# EAGLE design core (EAGLE 6.6.0)

## Sheet 1 of 2
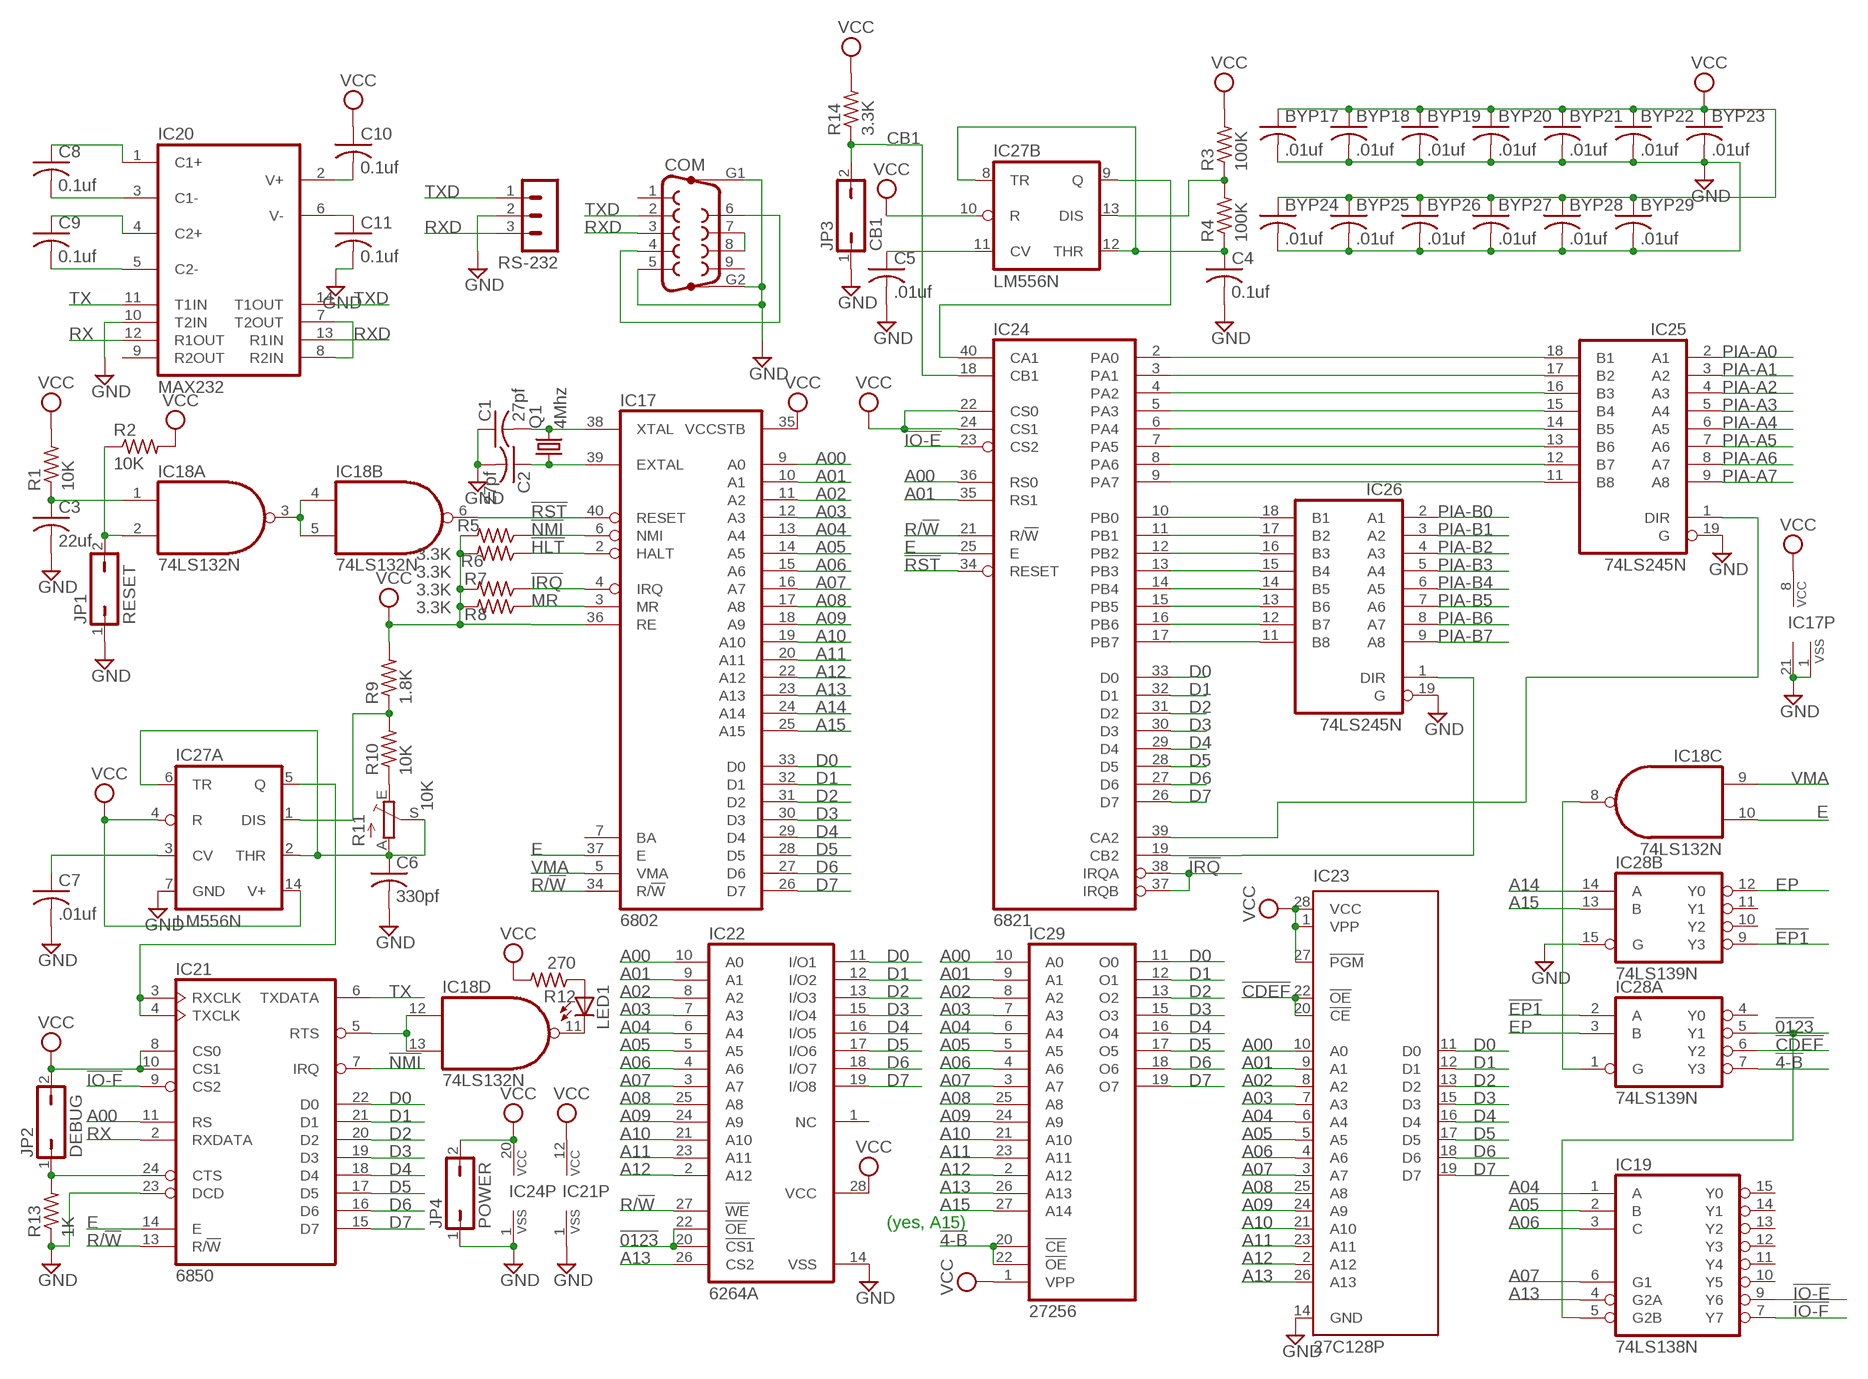
[diagram p0: schematic, sheet 1]

### Parts
BYP17  .01uf  C-US050-025X075  [C050-025X075]
BYP18  .01uf  C-US050-025X075  [C050-025X075]
BYP19  .01uf  C-US050-025X075  [C050-025X075]
BYP20  .01uf  C-US050-025X075  [C050-025X075]
BYP21  .01uf  C-US050-025X075  [C050-025X075]
BYP22  .01uf  C-US050-025X075  [C050-025X075]
BYP23  .01uf  C-US050-025X075  [C050-025X075]
BYP24  .01uf  C-US050-025X075  [C050-025X075]
BYP25  .01uf  C-US050-025X075  [C050-025X075]
BYP26  .01uf  C-US050-025X075  [C050-025X075]
BYP27  .01uf  C-US050-025X075  [C050-025X075]
BYP28  .01uf  C-US050-025X075  [C050-025X075]
BYP29  .01uf  C-US050-025X075  [C050-025X075]
C1  27pf  C-US050-025X075  [C050-025X075]
C2  27pf  C-US050-025X075  [C050-025X075]
C3  22uf  C-US102-043X133  [C102-043X133]
C4  0.1uf  C-US050-025X075  [C050-025X075]
C5  .01uf  C-US050-025X075  [C050-025X075]
C6  330pf  C-US050-025X075  [C050-025X075]
C7  .01uf  C-US050-025X075  [C050-025X075]
C8  0.1uf  C-US050-025X075  [C050-025X075]
C9  0.1uf  C-US050-025X075  [C050-025X075]
C10  0.1uf  C-US050-025X075  [C050-025X075]
C11  0.1uf  C-US050-025X075  [C050-025X075]
COM  F09HP  [F09HP]
IC17  6802  [DIL40]
IC18  74LS132N  74LS00N  [DIL14]
IC19  74LS138N  [DIL16]
IC20  MAX232  [DIL16]
IC21  6850  [DIL24]
IC22  6264A  [DIL28-6]
IC23  27C128P  [DIL28-6]
IC24  6821  [DIL40]
IC25  74LS245N  [DIL20]
IC26  74LS245N  [DIL20]
IC27  LM556N  [DIL14]
IC28  74LS139N  [DIL16]
IC29  27256  [DIL28]
JP1  RESET  JP1Q  [JP1]
JP2  DEBUG  JP1Q  [JP1]
JP3  CB1  JP1Q  [JP1]
JP4  POWER  JP1Q  [JP1]
LED1  LED3MM  [LED3MM]
Q1  4Mhz  CRYSTALHC18U-V  [HC18U-V]
R1  10K  R-US_0207/7  [0207/7]
R2  10K  R-US_0207/7  [0207/7]
R3  100K  R-US_0207/7  [0207/7]
R4  100K  R-US_0207/7  [0207/7]
R5  3.3K  R-US_0207/7  [0207/7]
R6  3.3K  R-US_0207/7  [0207/7]
R7  3.3K  R-US_0207/7  [0207/7]
R8  3.3K  R-US_0207/7  [0207/7]
R9  1.8K  R-US_0207/7  [0207/7]
R10  10K  R-US_0207/7  [0207/7]
R11  10K  TRIM_EU-B90P  [SP19L]
R12  270  R-US_0207/7  [0207/7]
R13  1K  R-US_0207/7  [0207/7]
R14  3.3K  R-US_0207/7  [0207/7]
RS-232  MA03-1  [MA03-1]

### Nets
!4-B: IC28.7(A:Y3) IC29.20(!CE) IC29.22(!OE)
!0123: IC19.5(G2B) IC22.20(!CS1) IC22.22(!OE) IC28.5(A:Y1)
!CDEF: IC23.20(!CE) IC23.22(!OE) IC28.6(A:Y2)
!EP1: IC28.2(A:A) IC28.9(B:Y3)
!HLT: IC17.2(HALT) R5.1
!IO-E: IC19.9(Y6) IC24.23(CS2)
!IO-F: IC19.7(Y7) IC21.9(CS2)
!IRQ: IC17.4(IRQ) IC24.37(IRQB) IC24.38(IRQA) R7.1
!NMI: IC17.6(NMI) IC21.7(IRQ) R6.1
!RST: IC17.40(RESET) IC18.6(B:O) IC24.34(RESET)
A00: IC17.9(A0) IC21.11(RS) IC22.10(A0) IC23.10(A0) IC24.36(RS0) IC29.10(A0)
A01: IC17.10(A1) IC22.9(A1) IC23.9(A1) IC24.35(RS1) IC29.9(A1)
A02: IC17.11(A2) IC22.8(A2) IC23.8(A2) IC29.8(A2)
A03: IC17.12(A3) IC22.7(A3) IC23.7(A3) IC29.7(A3)
A04: IC17.13(A4) IC19.1(A) IC22.6(A4) IC23.6(A4) IC29.6(A4)
A05: IC17.14(A5) IC19.2(B) IC22.5(A5) IC23.5(A5) IC29.5(A5)
A06: IC17.15(A6) IC19.3(C) IC22.4(A6) IC23.4(A6) IC29.4(A6)
A07: IC17.16(A7) IC19.6(G1) IC22.3(A7) IC23.3(A7) IC29.3(A7)
A08: IC17.17(A8) IC22.25(A8) IC23.25(A8) IC29.25(A8)
A09: IC17.18(A9) IC22.24(A9) IC23.24(A9) IC29.24(A9)
A10: IC17.19(A10) IC22.21(A10) IC23.21(A10) IC29.21(A10)
A11: IC17.20(A11) IC22.23(A11) IC23.23(A11) IC29.23(A11)
A12: IC17.22(A12) IC22.2(A12) IC23.2(A12) IC29.2(A12)
A13: IC17.23(A13) IC19.4(G2A) IC22.26(CS2) IC23.26(A13) IC29.26(A13)
A14: IC17.24(A14) IC28.14(B:A)
A15: IC17.25(A15) IC28.13(B:B) IC29.27(A14)
CB1: IC24.18(CB1) JP3.2 R14.1
D0: IC17.33(D0) IC21.22(D0) IC22.11(I/O1) IC23.11(D0) IC24.33(D0) IC29.11(O0)
D1: IC17.32(D1) IC21.21(D1) IC22.12(I/O2) IC23.12(D1) IC24.32(D1) IC29.12(O1)
D2: IC17.31(D2) IC21.20(D2) IC22.13(I/O3) IC23.13(D2) IC24.31(D2) IC29.13(O2)
D3: IC17.30(D3) IC21.19(D3) IC22.15(I/O4) IC23.15(D3) IC24.30(D3) IC29.15(O3)
D4: IC17.29(D4) IC21.18(D4) IC22.16(I/O5) IC23.16(D4) IC24.29(D4) IC29.16(O4)
D5: IC17.28(D5) IC21.17(D5) IC22.17(I/O6) IC23.17(D5) IC24.28(D5) IC29.17(O5)
D6: IC17.27(D6) IC21.16(D6) IC22.18(I/O7) IC23.18(D6) IC24.27(D6) IC29.18(O6)
D7: IC17.26(D7) IC21.15(D7) IC22.19(I/O8) IC23.19(D7) IC24.26(D7) IC29.19(O7)
E: IC17.37(E) IC18.10(C:I1) IC21.14(E) IC24.25(E)
EP: IC28.3(A:B) IC28.12(B:Y0)
GND [Power]: BYP17.2 BYP18.2 BYP19.2 BYP20.2 BYP21.2 BYP22.2 BYP23.2 BYP24.2 BYP25.2 BYP26.2 BYP27.2 BYP28.2 BYP29.2 C1.1 C2.2 C3.2 C4.2 C5.2 C6.2 C7.2 C11.2 COM.5 COM.G1 COM.G2 IC17.1(VSS) IC17.21(VSS) IC20.10(T2IN) IC21.1(VSS) IC21.23(DCD) IC22.14(VSS) IC23.14(GND) IC24.1(VSS) IC25.19(G) IC26.19(G) IC27.7(A:GND) IC28.15(B:G) JP1.1 JP3.1 JP4.1 R13.1 RS-232.2 ; also sheet 2
MR: IC17.3(MR) R8.1
N$1: COM.4 COM.6
N$3: C2.1 IC17.39(EXTAL) Q1.1
N$4: C1.2 IC17.38(XTAL) Q1.2
N$5: IC24.2(PA0) IC25.18(B1)
N$6: IC18.3(A:O) IC18.4(B:I0) IC18.5(B:I1)
N$21: C3.1 IC18.1(A:I0) R1.1
N$22: IC18.2(A:I1) JP1.2 R2.1
N$23: IC21.3(RXCLK) IC21.4(TXCLK) IC27.5(A:Q)
N$24: IC24.10(PB0) IC26.18(B1)
N$25: IC24.11(PB1) IC26.17(B2)
N$27: C6.1 IC27.2(A:THR) IC27.6(A:TR) R11.A R11.S
N$28: IC27.1(A:DIS) R9.1 R10.2
N$94: IC24.12(PB2) IC26.16(B3)
N$124: IC24.13(PB3) IC26.15(B4)
N$125: IC24.14(PB4) IC26.14(B5)
N$126: IC24.15(PB5) IC26.13(B6)
N$127: IC24.16(PB6) IC26.12(B7)
N$128: IC24.17(PB7) IC26.11(B8)
N$129: IC24.3(PA1) IC25.17(B2)
N$130: IC24.4(PA2) IC25.16(B3)
N$131: IC24.5(PA3) IC25.15(B4)
N$132: IC24.6(PA4) IC25.14(B5)
N$133: IC24.7(PA5) IC25.13(B6)
N$134: IC24.8(PA6) IC25.12(B7)
N$135: IC24.9(PA7) IC25.11(B8)
N$136: IC24.19(CB2) IC26.1(DIR)
N$137: IC24.39(CA2) IC25.1(DIR)
N$138: IC24.40(CA1) IC27.9(B:Q)
N$140: C4.1 IC27.8(B:TR) IC27.12(B:THR) R4.1
N$141: IC27.13(B:DIS) R3.1 R4.2
N$142: C5.1 IC27.11(B:CV)
N$143: R10.1 R11.E
N$145: COM.7 COM.8
N$147: IC18.12(D:I0) IC18.13(D:I1) IC21.5(RTS)
N$148: IC18.11(D:O) LED1.K(C)
N$149: LED1.A R12.1
N$150: IC21.24(CTS) JP2.1 R13.2
N$151: IC18.8(C:O) IC28.1(A:G)
N$153: IC20.7(T2OUT) IC20.8(R2IN)
N$154: C7.1 IC27.3(A:CV)
N$155: C9.2 IC20.5(C2-)
N$156: C9.1 IC20.4(C2+)
N$157: C8.2 IC20.3(C1-)
N$158: C8.1 IC20.1(C1+)
N$159: C11.1 IC20.6(V-)
N$160: C10.2 IC20.2(V+)
PIA-A0: IC25.2(A1) ; also sheet 2
PIA-A1: IC25.3(A2) ; also sheet 2
PIA-A2: IC25.4(A3) ; also sheet 2
PIA-A3: IC25.5(A4) ; also sheet 2
PIA-A4: IC25.6(A5) ; also sheet 2
PIA-A5: IC25.7(A6) ; also sheet 2
PIA-A6: IC25.8(A7) ; also sheet 2
PIA-A7: IC25.9(A8) ; also sheet 2
PIA-B0: IC26.2(A1) ; also sheet 2
PIA-B1: IC26.3(A2) ; also sheet 2
PIA-B2: IC26.4(A3) ; also sheet 2
PIA-B3: IC26.5(A4) ; also sheet 2
PIA-B4: IC26.6(A5) ; also sheet 2
PIA-B5: IC26.7(A6) ; also sheet 2
PIA-B6: IC26.8(A7) ; also sheet 2
PIA-B7: IC26.9(A8) ; also sheet 2
R/!W: IC17.34(R/!W) IC21.13(R/!W) IC22.27(!WE) IC24.21(R/!W)
RX: IC20.12(R1OUT) IC21.2(RXDATA)
RXD: COM.3 IC20.13(R1IN) RS-232.3
TX: IC20.11(T1IN) IC21.6(TXDATA)
TXD: COM.2 IC20.14(T1OUT) RS-232.1
VCC [Power]: BYP17.1 BYP18.1 BYP19.1 BYP20.1 BYP21.1 BYP22.1 BYP23.1 BYP24.1 BYP25.1 BYP26.1 BYP27.1 BYP28.1 BYP29.1 C10.1 IC17.8(VCC) IC17.35(VCCSTB) IC17.36(RE) IC21.8(CS0) IC21.10(CS1) IC21.12(VCC) IC22.28(VCC) IC23.1(VPP) IC23.27(!PGM) IC23.28(VCC) IC24.20(VCC) IC24.22(CS0) IC24.24(CS1) IC27.4(A:R) IC27.10(B:R) IC27.14(A:V+) IC29.1(VPP) JP2.2 JP4.2 R1.2 R2.2 R3.2 R5.2 R6.2 R7.2 R8.2 R9.2 R12.2 R14.2 ; also sheet 2
VMA: IC17.5(VMA) IC18.9(C:I0)
Unconnected: COM.1 COM.9 IC17.7(BA) IC19.10(Y5) IC19.11(Y4) IC19.12(Y3) IC19.13(Y2) IC19.14(Y1) IC19.15(Y0) IC20.9(R2OUT) IC22.1(NC) IC28.4(A:Y0) IC28.10(B:Y2) IC28.11(B:Y1)

### Notes on the sheet
- (yes, A15)

## Sheet 2 of 2
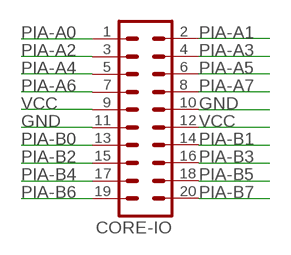
[diagram p1: schematic, sheet 2]

### Parts
CORE-IO  MA10-2  [MA10-2]

### Nets
GND [Power]: CORE-IO.10 CORE-IO.11 ; also sheet 1
PIA-A0: CORE-IO.1 ; also sheet 1
PIA-A1: CORE-IO.2 ; also sheet 1
PIA-A2: CORE-IO.3 ; also sheet 1
PIA-A3: CORE-IO.4 ; also sheet 1
PIA-A4: CORE-IO.5 ; also sheet 1
PIA-A5: CORE-IO.6 ; also sheet 1
PIA-A6: CORE-IO.7 ; also sheet 1
PIA-A7: CORE-IO.8 ; also sheet 1
PIA-B0: CORE-IO.13 ; also sheet 1
PIA-B1: CORE-IO.14 ; also sheet 1
PIA-B2: CORE-IO.15 ; also sheet 1
PIA-B3: CORE-IO.16 ; also sheet 1
PIA-B4: CORE-IO.17 ; also sheet 1
PIA-B5: CORE-IO.18 ; also sheet 1
PIA-B6: CORE-IO.19 ; also sheet 1
PIA-B7: CORE-IO.20 ; also sheet 1
VCC [Power]: CORE-IO.9 CORE-IO.12 ; also sheet 1

## Power pins joined to a net without a drawn wire
GND: IC18.7(P:GND) IC19.8(GND) IC20.15(GND) IC25.10(GND) IC26.10(GND) IC28.8(P:GND) IC29.14(GND)
VCC: IC18.14(P:VCC) IC19.16(VCC) IC20.16(VCC) IC25.20(VCC) IC26.20(VCC) IC28.16(P:VCC) IC29.28(VCC)

## Library data of the parts
BYP17-BYP29 C1-C11 = rcl:C-US: CAPACITOR, American symbol
COM = con-subd:F09HP: SUB-D; OC_FARNELL: unknown; OC_NEWARK: unknown
CORE-IO = con-lstb:MA10-2: PIN HEADER; OC_FARNELL: unknown; OC_NEWARK: unknown
IC17 = micro-motorola:6802: MICROCONTROLLER/MEMORY DEVICE; OC_FARNELL: unknown; OC_NEWARK: unknown
IC18 = 74xx-us:74*00: Quad 2-input NAND gate
IC19 = 74xx-us:74*138: 3-line to 8-line DECODER/DEMULTIPLEXER
IC20 = maxim:MAX232: RS232 TRANSCEIVER; MF: MAXIM; MPN: MAX232ACPE+; OC_FARNELL: 9723773; OC_NEWARK: 68K4544
IC21 = micro-motorola:6850: MICROCONTROLLER/MEMORY DEVICE; MF: NTE ELECTRONICS; MPN: NTE6850; OC_FARNELL: 4899775; OC_NEWARK: 31C2457
IC22 = memory-hitachi:6264A: MEMORY; OC_FARNELL: 283605; OC_NEWARK: unknown
IC23 = microchip:27*128: CMOS EPROM 128 K (16 K x 8); OC_FARNELL: unknown; OC_NEWARK: unknown
IC24 = micro-motorola:6821: MICROCONTROLLER/MEMORY DEVICE; MF: NTE ELECTRONICS; MPN: NTE6821; OC_FARNELL: 1652403; OC_NEWARK: 29C4772
IC25 IC26 = 74xx-us:74*245: Octal BUS TRANSCEIVER, 3-state
IC27 = linear:*556: Dual TIMER
IC28 = 74xx-us:74*139: Dual 2-line to 4-line DECODER/DEMULTIPLEXER
IC29 = memory:27256: MEMORY
JP1-JP4 = jumper:JP1Q: JUMPER
LED1 = led:LED: LED OSRAM: - CHIPLED LG R971, LG N971, LY N971, LG Q971, LY Q971, LO R971, LY R971 LH N974, LH R974 LS Q976, LO Q976, LY Q976 LO Q996 - Hyper CHIPLED LW Q18S LB Q993, LB Q99A, LB R99A - SideLED LS A670, LO A670, LY A670, LG A670, LP A670 LB A673, LV A673, LT A673, LW A673 LH A674 LY A675 LS A676, LA A676, LO A676, LY A676, LW A676 LS A679, LY A679, LG A679 - Hyper Micro SIDELED® LS Y876, LA Y876, LO Y876, LY Y876 LT Y87S - SmartLED LW L88C, LW L88S LB L89C, LB L89S, LG L890 LS L89K, LO L89K, LY L89K LS L896, LA L896, LO L896, LY L896 - TOPLED LS T670, LO T670, LY T670, LG T670, LP T670 LSG T670, LSP T670, LSY T670, LOP T670, LYG T670 LG T671, LOG T671, LSG T671 LB T673, LV T673, LT T673, LW T673 LH T674 LS T676, LA T676, LO T676, LY T676, LB T676, LH T676, LSB T676, LW T676 LB T67C, LV T67C, LT T67C, LS T67K, LO T67K, LY T67K, LW E67C LS E67B, LA E67B, LO E67B, LY E67B, LB E67C, LV E67C, LT E67C LW T67C LS T679, LY T679, LG T679 LS T770, LO T770, LY T770, LG T770, LP T770 LB T773, LV T773, LT T773, LW T773 LH T774 LS E675, LA E675, LY E675, LS T675 LS T776, LA T776, LO T776, LY T776, LB T776 LHGB T686 LT T68C, LB T68C - Hyper Mini TOPLED® LB M676 - Mini TOPLED Santana® LG M470 LS M47K, LO M47K, LY M47K Source: http://www.osram.convergy.de LUXEON: - LUMILED® LXK2-PW12-R00, LXK2-PW12-S00, LXK2-PW14-U00, LXK2-PW14-V00 LXK2-PM12-R00, LXK2-PM12-S00, LXK2-PM14-U00 LXK2-PE12-Q00, LXK2-PE12-R00, LXK2-PE12-S00, LXK2-PE14-T00, LXK2-PE14-U00 LXK2-PB12-K00, LXK2-PB12-L00, LXK2-PB12-M00, LXK2-PB14-N00, LXK2-PB14-P00, LXK2-PB14-Q00 LXK2-PR12-L00, LXK2-PR12-M00, LXK2-PR14-Q00, LXK2-PR14-R00 LXK2-PD12-Q00, LXK2-PD12-R00, LXK2-PD12-S00 LXK2-PH12-R00, LXK2-PH12-S00 LXK2-PL12-P00, LXK2-PL12-Q00, LXK2-PL12-R00 Source: www.luxeon.com KINGBRIGHT: KA-3528ASYC Source: www.kingbright.com
Q1 = crystal:CRYSTAL: CRYSTAL; OC_FARNELL: unknown; OC_NEWARK: unknown
R1-R10 R12-R14 = rcl:R-US_: RESISTOR, American symbol
R11 = pot:TRIM_EU-: POTENTIOMETER
RS-232 = con-lstb:MA03-1: PIN HEADER; OC_FARNELL: unknown; OC_NEWARK: unknown

## Net classes
1 Power: width 0.508 mm, drill 0.254 mm, clearance 0.254 mm

## Board
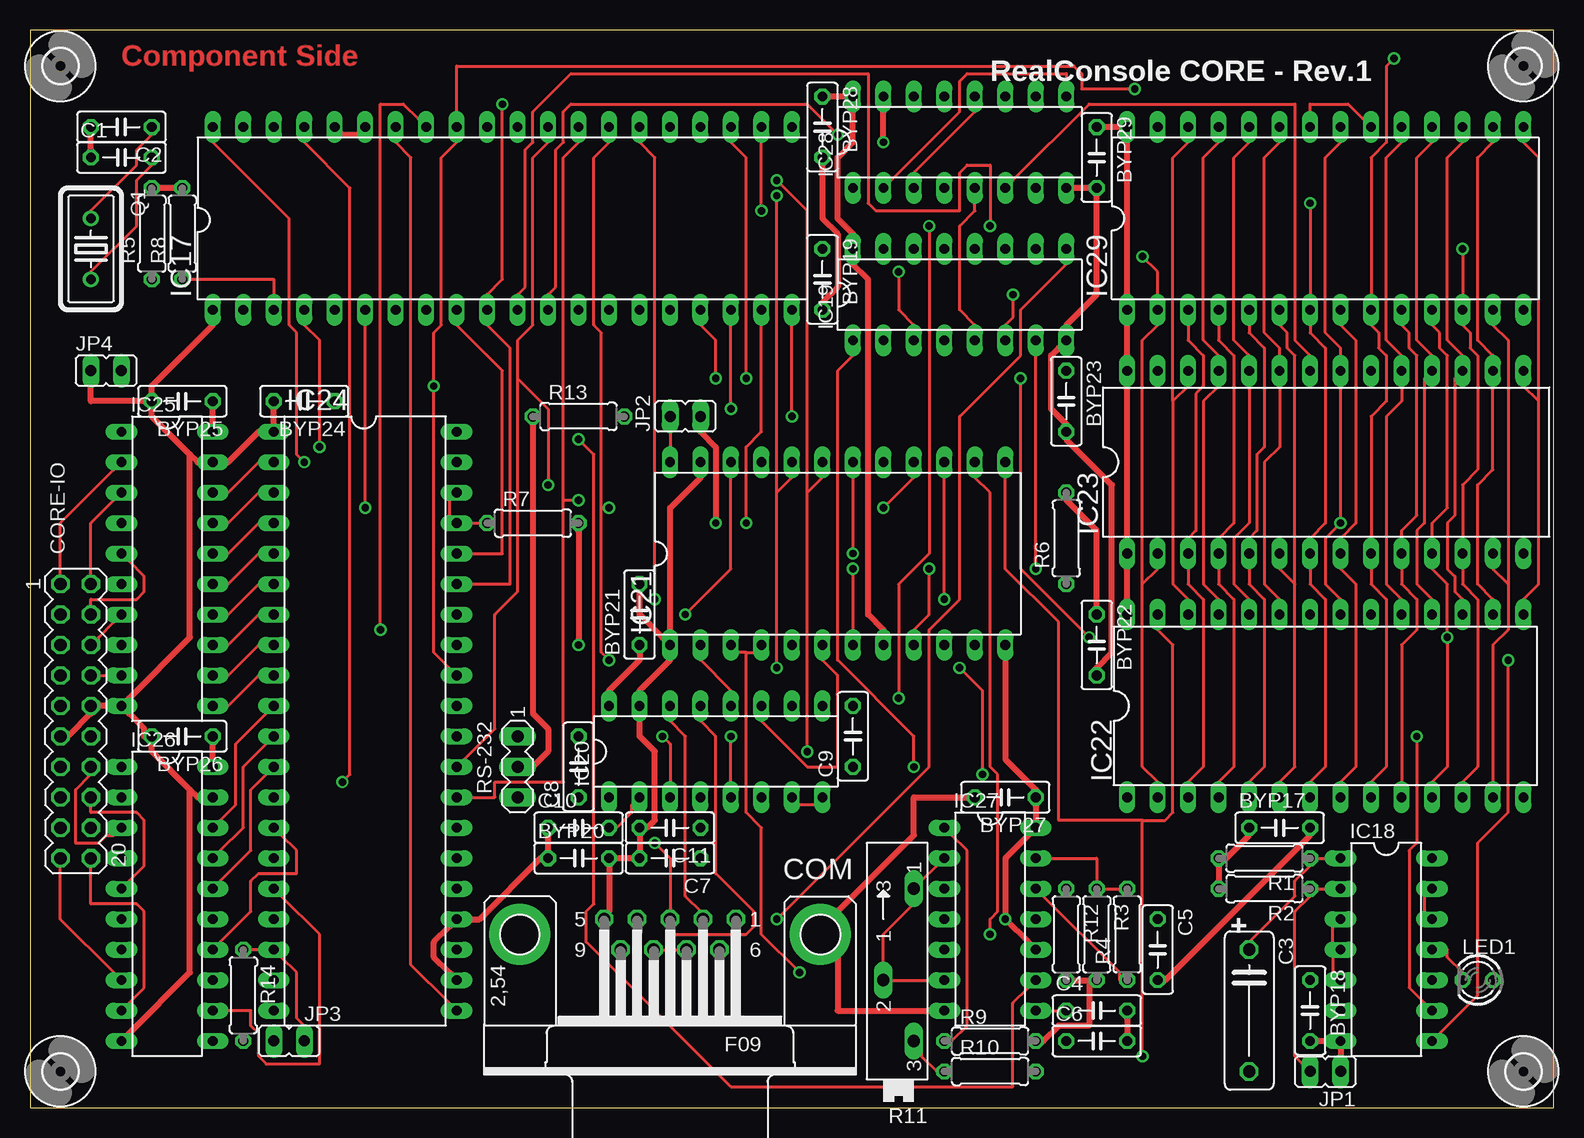
[diagram p2: board, top side]
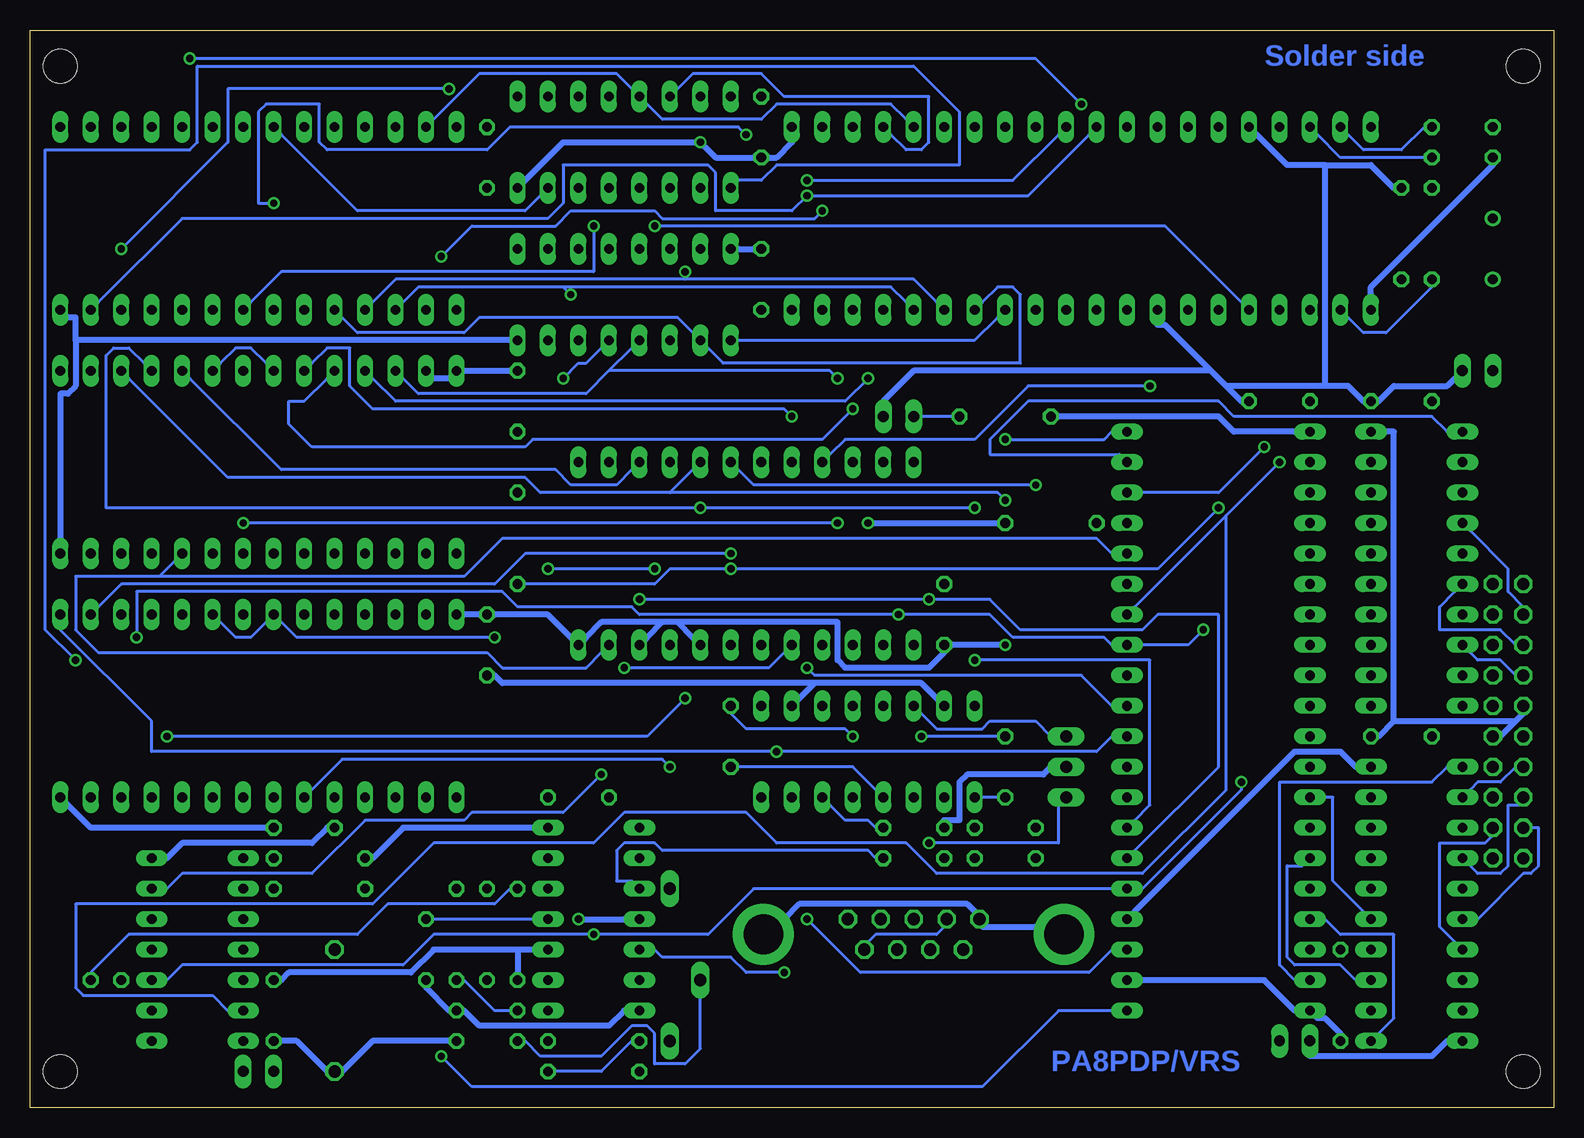
[diagram p3: board, bottom side, seen from below]

Size 126.98 x 89.84 mm. Coordinates in mm from the lower left corner, seen from the top.
Outline: 0,0 126.98,0 126.98,89.84 0,89.84 0,0
Copper layers (1*16): Top 0.035mm / dielectric 1.5mm / Bottom 0.035mm
Design rules "olimex10mil": minimum track width 10mil, minimum drill 24mil, track to track 10mil, track to pad 10mil, pad to pad 10mil, via to via 10mil, smd to smd 10mil, copper to edge 40mil, drill to drill 10mil, minimum pad ring 10mil, minimum via ring 8mil, stop-mask expansion 0mil, vias tented up to drill 0mil, thermal gap 10mil

### Footprints (pad centres in the part's own frame; a part is rotated, then mirrored left to right if it is on the bottom)
C050-025X075 = drill 0.813 octagon: 1 -2.54,0; 2 2.54,0
C102-043X133 = drill 1.016 octagon: 1 -5.08,0; 2 5.08,0
F09HP = drill 1.016 octagon: 1 -5.486,-1.27; 2 -2.743,-1.27; 3 0,-1.27; 4 2.743,-1.27; 5 5.486,-1.27; 6 -4.115,1.27; 7 -1.372,1.27; 8 1.372,1.27; 9 4.115,1.27 | drill 3.302 pad 5.08: G1 -12.522,0; G2 12.522,0
MA10-2 = drill 1.016 octagon: 1 -11.43,-1.27; 2 -11.43,1.27; 3 -8.89,-1.27; 4 -8.89,1.27; 5 -6.35,-1.27; 6 -6.35,1.27; 7 -3.81,-1.27; 8 -3.81,1.27; 9 -1.27,-1.27; 10 -1.27,1.27; 11 1.27,-1.27; 12 1.27,1.27; 13 3.81,-1.27; 14 3.81,1.27; 15 6.35,-1.27; 16 6.35,1.27; 17 8.89,-1.27; 18 8.89,1.27; 19 11.43,-1.27; 20 11.43,1.27
DIL40 = drill 0.813 long: 1 -24.13,-7.62; 2 -21.59,-7.62; 3 -19.05,-7.62; 4 -16.51,-7.62; 5 -13.97,-7.62; 6 -11.43,-7.62; 7 -8.89,-7.62; 8 -6.35,-7.62; 9 -3.81,-7.62; 10 -1.27,-7.62; 11 1.27,-7.62; 12 3.81,-7.62; 13 6.35,-7.62; 14 8.89,-7.62; 15 11.43,-7.62; 16 13.97,-7.62; 17 16.51,-7.62; 18 19.05,-7.62; 19 21.59,-7.62; 20 24.13,-7.62; 21 24.13,7.62; 22 21.59,7.62; 23 19.05,7.62; 24 16.51,7.62; 25 13.97,7.62; 26 11.43,7.62; 27 8.89,7.62; 28 6.35,7.62; 29 3.81,7.62; 30 1.27,7.62; 31 -1.27,7.62; 32 -3.81,7.62; 33 -6.35,7.62; 34 -8.89,7.62; 35 -11.43,7.62; 36 -13.97,7.62; 37 -16.51,7.62; 38 -19.05,7.62; 39 -21.59,7.62; 40 -24.13,7.62
DIL14 = drill 0.813 long: 1 -7.62,-3.81; 2 -5.08,-3.81; 3 -2.54,-3.81; 4 0,-3.81; 5 2.54,-3.81; 6 5.08,-3.81; 7 7.62,-3.81; 8 7.62,3.81; 9 5.08,3.81; 10 2.54,3.81; 11 0,3.81; 12 -2.54,3.81; 13 -5.08,3.81; 14 -7.62,3.81
DIL16 = drill 0.813 long: 1 -8.89,-3.81; 2 -6.35,-3.81; 3 -3.81,-3.81; 4 -1.27,-3.81; 5 1.27,-3.81; 6 3.81,-3.81; 7 6.35,-3.81; 8 8.89,-3.81; 9 8.89,3.81; 10 6.35,3.81; 11 3.81,3.81; 12 1.27,3.81; 13 -1.27,3.81; 14 -3.81,3.81; 15 -6.35,3.81; 16 -8.89,3.81
DIL24 = drill 0.813 long: 1 -13.97,-7.62; 2 -11.43,-7.62; 3 -8.89,-7.62; 4 -6.35,-7.62; 5 -3.81,-7.62; 6 -1.27,-7.62; 7 1.27,-7.62; 8 3.81,-7.62; 9 6.35,-7.62; 10 8.89,-7.62; 11 11.43,-7.62; 12 13.97,-7.62; 13 13.97,7.62; 14 11.43,7.62; 15 8.89,7.62; 16 6.35,7.62; 17 3.81,7.62; 18 1.27,7.62; 19 -1.27,7.62; 20 -3.81,7.62; 21 -6.35,7.62; 22 -8.89,7.62; 23 -11.43,7.62; 24 -13.97,7.62
DIL28-6 = drill 0.813 long: 1 -16.51,-7.62; 2 -13.97,-7.62; 3 -11.43,-7.62; 4 -8.89,-7.62; 5 -6.35,-7.62; 6 -3.81,-7.62; 7 -1.27,-7.62; 8 1.27,-7.62; 9 3.81,-7.62; 10 6.35,-7.62; 11 8.89,-7.62; 12 11.43,-7.62; 13 13.97,-7.62; 14 16.51,-7.62; 15 16.51,7.62; 16 13.97,7.62; 17 11.43,7.62; 18 8.89,7.62; 19 6.35,7.62; 20 3.81,7.62; 21 1.27,7.62; 22 -1.27,7.62; 23 -3.81,7.62; 24 -6.35,7.62; 25 -8.89,7.62; 26 -11.43,7.62; 27 -13.97,7.62; 28 -16.51,7.62
DIL20 = drill 0.813 long: 1 -11.43,-3.81; 2 -8.89,-3.81; 3 -6.35,-3.81; 4 -3.81,-3.81; 5 -1.27,-3.81; 6 1.27,-3.81; 7 3.81,-3.81; 8 6.35,-3.81; 9 8.89,-3.81; 10 11.43,-3.81; 11 11.43,3.81; 12 8.89,3.81; 13 6.35,3.81; 14 3.81,3.81; 15 1.27,3.81; 16 -1.27,3.81; 17 -3.81,3.81; 18 -6.35,3.81; 19 -8.89,3.81; 20 -11.43,3.81
DIL28 = drill 0.813 long: 1 -16.51,-7.62; 2 -13.97,-7.62; 3 -11.43,-7.62; 4 -8.89,-7.62; 5 -6.35,-7.62; 6 -3.81,-7.62; 7 -1.27,-7.62; 8 1.27,-7.62; 9 3.81,-7.62; 10 6.35,-7.62; 11 8.89,-7.62; 12 11.43,-7.62; 13 13.97,-7.62; 14 16.51,-7.62; 15 16.51,7.62; 16 13.97,7.62; 17 11.43,7.62; 18 8.89,7.62; 19 6.35,7.62; 20 3.81,7.62; 21 1.27,7.62; 22 -1.27,7.62; 23 -3.81,7.62; 24 -6.35,7.62; 25 -8.89,7.62; 26 -11.43,7.62; 27 -13.97,7.62; 28 -16.51,7.62
JP1 = drill 0.914 long: 1 0,-1.27; 2 0,1.27
LED3MM = drill 0.813 octagon: A -1.27,0; K 1.27,0
HC18U-V = drill 0.813: 1 -2.54,0; 2 2.54,0
0207/7 = drill 0.813 octagon: 1 -3.81,0; 2 3.81,0
SP19L = drill 1.016 long: A 5.715,-1.27; E -6.985,-1.27; S -1.905,1.27
MA03-1 = drill 1.016 long: 1 -2.54,0; 2 0,0; 3 2.54,0
2,8 = hole 2.8: 0,0

### Placement (x,y rotation side)
BYP17  104.14,23.33 0 top
BYP18  106.68,8.09 270 top
BYP19  66.04,69.05 270 top
BYP20  45.71,20.79 0 top
BYP21  50.79,41.11 90 top
BYP22  88.9,38.57 270 top
BYP23  86.36,58.89 270 top
BYP24  22.86,58.89 180 top
BYP25  12.69,58.89 180 top
BYP26  12.69,30.95 180 top
BYP27  81.28,25.87 180 top
BYP28  66.04,81.75 270 top
BYP29  88.9,79.21 270 top
C1  7.62,79.21 0 top
C2  7.62,81.75 180 top
C3  101.59,8.09 270 top
C4  88.9,8.09 0 top
C5  93.98,13.17 270 top
C6  88.9,5.55 0 top
C7  53.34,20.79 180 top
C8  45.71,28.41 90 top
C9  68.58,30.95 90 top
C10  45.71,23.33 0 top
C11  53.34,23.33 180 top
COM  53.34,14.44 180 top
CORE-IO  3.81,32.22 270 top
IC17  39.36,74.13 0 top
IC18  113.03,13.17 270 top
IC19  77.47,67.78 0 top
IC20  57.14,29.68 0 top
IC21  67.31,46.19 0 top
IC22  107.95,33.49 0 top
IC23  107.95,53.81 0 top
IC24  27.94,32.22 270 top
IC25  11.42,44.92 270 top
IC26  11.42,16.98 270 top
IC27  80.01,15.71 270 top
IC28  77.47,80.48 0 top
IC29  107.95,74.13 0 top
JP1  107.95,3.01 90 top
JP2  54.6,57.62 270 top
JP3  21.59,5.55 270 top
JP4  6.34,61.43 270 top
LED1  120.65,10.63 180 top
Q1  5.08,71.59 270 top
R1  102.87,20.79 180 top
R2  102.87,18.25 180 top
R3  88.9,14.44 270 top
R4  91.44,14.44 90 top
R5  10.15,72.86 90 top
R6  86.36,47.46 90 top
R7  41.9,48.73 0 top
R8  12.69,72.86 90 top
R9  80.01,5.55 0 top
R10  80.01,3.01 0 top
R11  72.39,12.54 90 top
R12  86.36,14.44 270 top
R13  45.71,57.62 0 top
R14  17.78,9.36 270 top
RS-232  40.63,28.41 270 top
U$3  [2,8]  2.54,86.83 0 top
U$4  [2,8]  2.54,3.01 0 top
U$5  [2,8]  124.45,86.83 0 top
U$6  [2,8]  124.45,3.01 0 top

### Tracks (layer width: path | path; a pad name or v marks a point on that pad's centre or on a via)
!4-B
  Top 0.254: IC29.20 111.12,82.39 109.85,83.66 106.68,83.66 106.68,83.02 IC29.22
  Bottom 0.254: IC28.7 84.45,76.03 85.72,74.77 99.69,74.77 106.04,81.11 IC29.22
!0123  (via drill 0.61)
  Top 0.254: IC19.5 78.73,65.24 77.47,66.51 77.47,73.5 78.73,74.77 78.73,75.4 IC28.5 | v88.26,39.2 82.55,44.92 v82.55,60.8
  Bottom 0.254: IC22.20 111.12,40.48 109.85,39.2 108.58,39.2 107.31,40.48 IC22.22 106.04,40.48 104.77,39.2 v88.26,39.2 | v82.55,60.8 81.28,62.06 80.64,62.06 79.37,63.34 IC19.5
!CDEF
  Top 0.254: IC28.6 81.91,77.3 88.26,83.66 105.41,83.66 105.41,63.97 106.68,62.7 IC23.22
  Bottom 0.254: IC23.22 107.31,62.06 108.58,63.34 109.85,63.34 111.12,62.06 IC23.20
!EP1
  Top 0.254: IC28.2 71.75,77.3 77.47,83.02 77.47,85.56 78.1,86.19 86.36,86.19 86.36,85.56 IC28.9
!HLT
  Bottom 0.254: R5.1 10.15,68.41 13.96,64.61 15.87,64.61 17.14,65.88 IC17.2
!IO-E  (via drill 0.61)
  Top 0.254: v62.22,15.71 74.93,28.41 74.93,39.84 77.47,42.38 77.47,57.62 82.55,62.7 82.55,66.51 86.36,70.32 IC19.9
  Bottom 0.254: v62.22,15.71 57.78,11.27 38.73,11.27 36.82,13.17 IC24.23
!IO-F  (via drill 0.61)
  Top 0.254: v74.93,44.92 74.93,41.11 73.66,39.84 IC21.9 | v83.81,44.92 83.81,62.7 IC19.7
  Bottom 0.254: v74.93,44.92 v83.81,44.92
!IRQ  (via drill 0.61)
  Top 0.254: R7.1 37.46,48.73 36.82,48.73 IC24.37 34.92,49.37 34.92,50.63 IC24.38 | v24.12,55.08 24.12,63.97 22.86,65.24 IC17.4
  Bottom 0.254: v24.12,55.08 27.94,51.27 34.28,51.27 IC24.38
!NMI  (via drill 0.61)
  Top 0.254: v27.94,50 27.94,65.24 IC17.6 | v68.58,44.92 68.58,39.84 IC21.7
  Bottom 0.254: v27.94,50 33.02,44.92 v68.58,44.92 73.66,44.92 74.93,43.65 85.72,43.65 R6.1
!RST  (via drill 0.61)
  Top 0.254: v22.86,53.81 22.22,54.45 22.22,64.61 21.59,65.24 21.59,74.13 15.23,80.48 IC17.40
  Bottom 0.254: 27.3,49.37 v22.86,53.81 | 27.3,49.37 34.92,41.74 IC24.34 | 27.3,49.37 27.3,26.5 34.28,19.52 51.43,19.52 53.97,22.06 64.77,22.06 67.31,24.6 77.47,24.6 80.01,22.06 93.34,22.06 98.42,16.98 123.19,16.98 123.19,10 122.55,9.36 111.76,9.36 110.48,8.09 IC18.6
A00
  Top 0.254: IC24.36 36.82,46.19 39.36,46.19 39.36,61.43 35.55,65.24 IC17.9 | IC22.10 114.3,27.14 114.3,38.57 115.56,39.84 115.56,42.38 114.3,43.65 114.3,44.92 IC23.10 114.3,47.46 114.3,48.09 115.56,49.37 115.56,62.7 114.93,63.34 114.93,64.61 114.3,65.24 IC29.10
  Bottom 0.254: 116.2,44.28 123.19,44.28 123.19,39.84 121.28,37.94 88.9,37.94 87.62,36.66 80.64,36.66 79.37,37.94 IC21.11 | 116.2,44.28 114.93,45.55 IC23.10 | 116.2,44.28 90.8,44.28 87.62,47.46 38.09,47.46 36.82,46.19 IC24.36
A01  (via drill 0.61)
  Top 0.254: IC24.35 36.82,43.65 40,43.65 40,63.34 38.09,65.24 IC17.10 38.09,67.78 39.36,69.05 v39.36,83.66 | IC22.9 111.76,27.14 113.03,28.41 113.03,42.38 111.76,43.65 111.76,44.92 IC23.9 111.76,47.46 111.76,57.62 113.03,58.89 113.03,62.7 112.39,63.34 112.39,64.61 111.76,65.24 IC29.9 111.76,67.78 111.76,79.21 113.03,80.48 113.03,86.83 v113.66,87.47
  Bottom 0.254: v39.36,83.66 43.17,87.47 v113.66,87.47
A02  (via drill 0.61)
  Top 0.254: IC22.8 109.22,27.14 110.48,28.41 110.48,43.65 109.22,44.92 IC23.8 109.22,47.46 110.48,48.73 110.48,63.97 109.22,65.24 IC29.8 | v80.01,73.5 80.01,78.58 78.1,78.58 77.47,77.94 77.47,74.77 70.48,74.77 69.84,75.4 69.84,86.19 45.08,86.19 41.9,83.02 41.9,80.48 41.27,79.84 41.27,68.41 40.63,67.78 IC17.11
  Bottom 0.254: v80.01,73.5 80.01,69.69 106.04,69.69 108.58,67.14 IC29.8
A03  (via drill 0.61)
  Top 0.254: IC22.7 106.68,27.14 107.95,28.41 107.95,42.38 106.68,43.65 106.68,44.92 IC23.7 106.68,47.46 107.95,48.73 107.95,63.34 106.68,64.61 106.68,65.24 IC29.7 106.68,67.78 v106.68,75.4 | v67.31,81.11 64.77,83.66 45.08,83.66 44.45,83.02 44.45,80.48 43.81,79.84 43.81,68.41 43.17,67.78 IC17.12
  Bottom 0.254: v67.31,81.11 67.94,81.75 86.99,81.75 88.9,79.84 102.23,79.84 102.87,80.48 102.87,83.66 107.31,83.66 107.95,83.02 107.95,75.4 v106.68,75.4
A04  (via drill 0.61)
  Top 0.254: 105.41,43.65 105.41,28.41 104.14,27.14 IC22.6 | 105.41,43.65 104.14,44.92 IC23.6 | 105.41,43.65 105.41,62.7 104.77,63.34 104.77,64.61 104.14,65.24 IC29.6 | v73.66,28.41 73.66,30.95 67.31,37.3 67.31,61.43 68.58,62.7 IC19.1
  Bottom 0.254: IC17.13 46.35,65.88 48.25,63.97 67.94,63.97 IC19.1 | v73.66,28.41 74.29,29.04 100.96,29.04 103.5,26.5 IC22.6
A05
  Top 0.254: IC22.5 101.59,27.14 102.87,28.41 102.87,42.38 101.59,43.65 101.59,44.92 IC23.5 101.59,47.46 102.23,48.09 102.23,54.45 102.87,55.08 102.87,63.34 101.59,64.61 101.59,65.24 IC29.5
  Bottom 0.254: IC29.5 100.96,65.88 99.69,64.61 90.8,64.61 89.53,65.88 73.02,65.88 71.75,64.61 IC19.2 70.48,63.34 69.21,62.06 44.45,62.06 44.45,67.78 45.08,68.41 46.35,68.41 47.62,67.14 IC17.14
A06  (via drill 0.61)
  Top 0.254: IC22.4 99.06,27.14 100.33,28.41 100.33,42.38 99.06,43.65 99.06,44.92 IC23.4 99.06,47.46 100.33,48.73 100.33,62.7 99.06,63.97 99.06,65.24 IC29.4 | v72.39,69.69 72.39,66.51 73.66,65.24 IC19.3
  Bottom 0.254: 72.39,69.05 96.52,69.05 98.42,67.14 IC29.4 | 72.39,69.05 53.34,69.05 51.43,67.14 IC17.15 | 72.39,69.05 v72.39,69.69
A07  (via drill 0.61)
  Top 0.254: IC22.3 96.52,27.14 97.79,28.41 97.79,42.38 96.52,43.65 96.52,44.92 IC23.3 96.52,47.46 97.15,48.09 97.15,59.52 97.79,60.16 97.79,62.7 96.52,63.97 96.52,65.24 IC29.3 | v81.91,67.78 81.91,65.88 81.28,65.24 IC19.6
  Bottom 0.254: 82.55,68.41 v81.91,67.78 | 82.55,68.41 94.61,68.41 95.88,67.14 IC29.3 | 82.55,68.41 55.24,68.41 53.97,67.14 IC17.16
A08  (via drill 0.61)
  Top 0.254: IC22.25 99.06,42.38 97.79,43.65 97.79,58.89 99.06,60.16 IC23.25 99.06,62.7 97.79,63.97 97.79,79.21 99.06,80.48 IC29.25 | v57.14,60.8 57.14,63.97 55.88,65.24 IC17.17
  Bottom 0.254: v57.14,60.8 59.05,58.89 96.52,58.89 98.42,60.8 IC23.25
A09  (via drill 0.61)
  Top 0.254: IC22.24 101.59,42.38 100.33,43.65 100.33,47.46 101.59,48.73 101.59,60.16 IC23.24 101.59,62.7 100.33,63.97 100.33,79.21 101.59,80.48 IC29.24 | v58.41,58.25 58.41,65.24 IC17.18
  Bottom 0.254: v58.41,58.25 60.95,55.71 85.09,55.71 85.72,55.08 103.5,55.08 105.41,56.98 105.41,58.89 104.14,58.89 102.23,60.8 IC23.24
A10  (via drill 0.61)
  Top 0.254: IC22.21 109.22,42.38 107.95,43.65 107.95,47.46 v109.22,48.73 109.22,60.16 IC23.21 109.22,62.7 109.22,63.34 107.95,64.61 107.95,79.21 109.22,80.48 IC29.21 | v59.68,48.73 59.68,55.08 60.95,56.35 60.95,65.24 IC17.19
  Bottom 0.254: v59.68,48.73 v109.22,48.73
A11  (via drill 0.61)
  Top 0.254: IC22.23 104.14,42.38 102.87,43.65 102.87,53.81 104.14,55.08 104.14,60.16 IC23.23 104.14,62.7 104.14,63.34 102.87,64.61 102.87,79.21 104.14,80.48 IC29.23 | v63.49,57.62 63.49,65.24 IC17.20
  Bottom 0.254: v63.49,57.62 64.13,58.25 98.42,58.25 100.33,60.16 100.33,63.34 102.23,63.34 103.5,62.06 IC23.23
A12  (via drill 0.61)
  Top 0.254: 92.7,43.65 92.7,28.41 93.98,27.14 IC22.2 | 92.7,43.65 93.98,44.92 IC23.2 | 92.7,43.65 92.7,63.97 93.98,65.24 IC29.2 93.98,67.78 93.98,69.69 v92.7,70.95 | v60.95,74.77 60.95,80.48 IC17.22
  Bottom 0.254: v60.95,74.77 61.59,74.13 74.29,74.13 74.93,74.77 81.91,74.77 83.18,73.5 90.17,73.5 v92.7,70.95
A13  (via drill 0.61)
  Top 0.254: 95.25,58.89 95.25,43.65 96.52,42.38 IC22.26 | 95.25,58.89 96.52,60.16 IC23.26 | v59.68,60.8 59.68,79.21 58.41,80.48 IC17.23 | 95.25,58.89 95.25,79.21 96.52,80.48 IC29.26
  Bottom 0.254: 78.73,61.43 80.64,59.52 94.61,59.52 95.88,60.8 IC23.26 | 78.73,61.43 76.83,63.34 IC19.4 | v59.68,60.8 60.32,61.43 78.73,61.43
A14
  Bottom 0.254: IC17.24 55.24,81.11 53.97,79.84 52.7,79.84 52.06,80.48 52.06,84.29 64.13,84.29 66.04,86.19 71.75,86.19 73.02,84.92 IC28.14
A15
  Bottom 0.254: IC17.25 53.97,82.39 55.24,83.66 64.77,83.66 66.04,82.39 74.29,82.39 75.56,83.66 IC28.13 76.83,84.92 78.1,86.19 89.53,86.19 93.34,82.39 IC29.27
CB1
  Top 0.254: R14.1 18.41,13.17 19.05,13.17 IC24.18 20.95,12.54 22.22,11.27 22.22,7.46 22.86,6.82 JP3.2
D0  (via drill 0.61)
  Top 0.254: IC22.11 116.84,27.14 118.11,28.41 v118.11,39.2 118.11,43.65 116.84,44.92 IC23.11 116.84,47.46 116.84,48.73 118.11,50 118.11,62.7 117.47,63.34 117.47,64.61 116.84,65.24 IC29.11 | v54.6,41.11 58.41,44.92 58.41,52.54 IC21.22 | v29.21,39.84 29.21,83.66 31.11,83.66 32.38,82.39 IC17.33
  Bottom 0.254: v29.21,39.84 30.48,38.57 34.28,38.57 IC24.33 36.82,38.57 37.46,39.2 45.08,39.2 46.98,41.11 v54.6,41.11 76.2,41.11 76.83,41.74 86.36,41.74 87.62,43.02 118.11,43.02 v118.11,39.2
D1  (via drill 0.61)
  Top 0.254: IC22.12 119.38,27.14 120.65,28.41 120.65,42.38 119.38,43.65 119.38,44.92 IC23.12 119.38,47.46 119.38,51.91 120.65,53.17 120.65,62.7 120.01,63.34 120.01,64.61 119.38,65.24 IC29.12 119.38,67.78 v119.38,71.59 | IC24.32 34.92,36.66 33.65,37.94 v33.65,60.16 33.65,64.61 34.28,65.24 34.28,79.21 35.55,80.48 IC17.32 35.55,83.02 35.55,86.83 86.99,86.83 87.62,86.19 87.62,84.92 v92.07,84.92
  Bottom 0.254: v33.65,60.16 43.81,60.16 48.25,55.71 59.05,55.71 60.32,54.45 IC21.21 | v119.38,71.59 110.48,80.48 110.48,84.92 v92.07,84.92
D2  (via drill 0.61)
  Top 0.254: 123.19,43.65 123.19,39.84 121.92,38.57 121.92,27.14 IC22.13 | 123.19,43.65 121.92,44.92 IC23.13 | 123.19,43.65 123.19,63.97 121.92,65.24 IC29.13 | v62.22,36.66 62.22,51.27 | 62.22,51.27 63.49,52.54 IC21.20 | 62.22,51.27 v62.22,76.03
  Bottom 0.254: v62.22,36.66 61.59,36.03 39.36,36.03 36.82,33.49 IC24.31 | IC17.31 38.73,81.11 43.81,76.03 v62.22,76.03 63.49,74.77 69.84,74.77 69.84,77.94 70.48,78.58 82.55,78.58 82.55,75.4 83.81,74.13 114.3,74.13 121.28,67.14 IC29.13
D3  (via drill 0.61)
  Top 0.254: 125.73,58.89 125.73,43.65 124.45,42.38 IC22.15 | 125.73,58.89 124.45,60.16 IC23.15 | 125.73,58.89 125.73,79.21 124.45,80.48 IC29.15 | v64.77,29.68 64.77,51.27 | 64.77,51.27 66.04,52.54 IC21.19 | v62.22,77.3 64.77,74.77 64.77,51.27
  Bottom 0.254: IC24.30 36.82,30.95 38.09,29.68 v64.77,29.68 116.84,29.68 116.84,32.22 124.45,39.84 IC22.15 | v62.22,77.3 45.08,77.3 41.27,81.11 IC17.30
D4  (via drill 0.61)
  Top 0.254: IC22.16 121.92,42.38 120.65,43.65 120.65,51.91 121.92,53.17 121.92,60.16 IC23.16 121.92,62.7 120.65,63.97 120.65,79.21 121.92,80.48 IC29.16 | 40.63,60.8 40.63,63.97 41.9,65.24 41.9,79.21 43.17,80.48 IC17.29 | 40.63,60.8 40.63,43.02 38.73,41.11 38.73,31.58 36.19,29.04 IC24.29 | v43.17,51.91 43.17,58.25 40.63,60.8 | v68.58,46.19 68.58,52.54 IC21.18
  Bottom 0.254: v43.17,51.91 66.67,51.91 67.94,53.17 IC21.18 | v68.58,46.19 85.72,46.19 88.26,43.65 119.38,43.65 121.28,41.74 IC22.16
D5  (via drill 0.61)
  Top 0.254: 44.45,50.63 44.45,79.21 45.71,80.48 IC17.28 | 44.45,50.63 44.45,27.14 38.73,27.14 38.73,25.87 36.82,25.87 IC24.28 | IC22.17 119.38,42.38 118.74,43.02 118.74,44.28 118.11,44.92 118.11,48.73 118.74,49.37 118.74,60.8 IC23.17 119.38,62.7 118.11,63.97 118.11,79.21 119.38,80.48 IC29.17 | 44.45,50.63 v45.71,50.63
  Bottom 0.254: 73.66,51.27 71.75,53.17 IC21.17 | 73.66,51.27 84.45,51.27 85.72,52.54 110.48,52.54 118.74,60.8 IC23.17 | v45.71,50.63 46.35,51.27 73.66,51.27
D6  (via drill 0.61)
  Top 0.254: IC22.18 116.84,42.38 115.56,43.65 115.56,48.09 116.2,48.73 116.2,60.8 IC23.18 116.84,62.7 115.56,63.97 115.56,79.21 116.84,80.48 IC29.18 | v48.25,37.3 47.62,37.94 47.62,50 | 47.62,50 47.62,64.61 46.98,65.24 46.98,79.21 48.25,80.48 IC17.27 | v71.12,50 73.66,52.54 IC21.16 | 47.62,50 v48.25,50
  Bottom 0.254: v48.25,37.3 33.65,37.3 33.65,25.23 34.92,23.96 IC24.27 | v48.25,50 v71.12,50 120.65,50 120.65,62.7 120.01,63.34 118.74,63.34 117.47,62.06 IC23.18
D7  (via drill 0.61)
  Top 0.254: IC22.19 114.3,42.38 113.03,43.65 113.03,57.62 114.3,58.89 114.3,60.16 IC23.19 114.3,62.7 113.03,63.97 113.03,79.21 114.3,80.48 IC29.19 | v76.2,42.38 76.2,52.54 IC21.15 | v52.06,42.38 52.06,79.21 50.79,80.48 IC17.26
  Bottom 0.254: v76.2,42.38 v52.06,42.38 46.98,42.38 44.45,39.84 34.28,39.84 33.02,41.11 27.94,41.11 27.94,28.41 34.92,21.42 IC24.26 | IC23.19 113.66,60.8 106.04,53.17 83.18,53.17 81.91,51.91 78.1,51.91 76.83,53.17 IC21.15
E  (via drill 0.61)
  Top 0.254: v26.03,27.14 26.67,27.77 26.67,76.67 22.86,80.48 IC17.37 | v80.01,14.44 80.01,15.71 80.64,16.34 80.64,27.77 80.01,28.41 80.01,51.27 78.73,52.54 IC21.14
  Bottom 0.254: IC18.10 115.56,10.63 114.3,11.9 95.88,11.9 93.34,14.44 v80.01,14.44 70.48,14.44 66.67,18.25 36.82,18.25 IC24.25 34.28,18.25 26.03,26.5 v26.03,27.14
EP
  Top 0.254: IC28.3 73.66,77.94 78.73,83.02 IC28.12
GND  (via drill 0.61)
  Top 0.508: IC25.10 6.34,33.49 5.71,33.49 CORE-IO.10 5.08,32.85 3.17,30.95 CORE-IO.11 | 13.33,26.5 10.15,29.68 10.15,30.31 BYP26.2 9.52,30.95 9.52,31.58 8.25,32.85 IC25.10 | 13.33,26.5 13.96,25.87 IC26.19 | 13.33,26.5 13.33,11.27 8.25,6.18 IC26.10 | BYP24.2 20.32,58.25 20.32,56.98 IC24.1 19.05,56.35 16.51,53.81 IC25.19 13.96,53.81 13.33,54.45 | C1.1 5.08,79.84 5.08,81.11 C2.2 | BYP25.2 9.52,58.89 5.08,58.89 5.08,60.16 JP4.1 | IC17.1 15.23,65.24 10.15,60.16 10.15,59.52 BYP25.2 | 13.33,54.45 10.15,57.62 10.15,58.25 BYP25.2 | 13.33,54.45 13.33,39.2 8.25,34.12 IC25.10 | IC28.8 86.99,76.67 88.26,76.67 BYP29.2 88.9,76.03 88.9,67.78 86.36,65.24 IC19.8 85.72,63.34 85.09,62.7 85.09,58.25 86.36,56.98 BYP23.2 86.36,55.71 90.17,51.91 90.17,37.94 88.9,36.66 BYP22.2 | BYP19.2 66.04,67.14 67.31,68.41 67.31,72.86 66.04,74.13 66.04,78.58 BYP28.2 | v71.12,80.48 71.12,83.02 IC28.15 | IC27.7 74.93,8.09 67.31,8.09 67.31,12.54 COM.G1 67.31,16.34 73.66,22.7 73.66,25.87 78.1,25.87 BYP27.2 | BYP18.2 107.31,5.55 107.95,5.55 IC18.7 109.22,4.92 109.22,4.28 JP1.1 | C6.2 91.44,6.18 91.44,7.46 C4.2 | BYP17.2 106.68,22.7 94.61,10.63 C5.2 | COM.5 48.25,16.34 48.25,20.15 BYP20.2 48.89,20.79 50.16,20.79 C7.2 50.79,21.42 50.79,22.7 C11.2 51.43,23.33 52.06,23.96 52.06,29.68 50.79,30.95 50.79,32.22 IC20.15 50.79,34.76 53.34,37.3 IC21.1 | BYP21.2 50.79,43.02 50.79,41.11 52.7,39.2 IC21.1 | IC21.23 55.88,52.54 53.34,50 53.34,39.84 IC21.1 | R13.1 41.9,56.98 41.9,32.85 43.17,31.58 43.17,29.68 41.9,28.41 RS-232.2
  Bottom 0.508: IC26.10 8.88,5.55 10.15,4.28 20.32,4.28 JP3.1 | R13.1 41.27,57.62 27.94,57.62 26.67,56.35 21.59,56.35 IC24.1 | C1.1 5.08,78.58 15.23,68.41 15.23,67.78 IC17.1 | 123.19,63.97 123.19,65.88 123.82,65.88 IC29.14 | 123.19,63.97 123.19,60.16 123.82,59.52 124.45,59.52 124.45,47.46 IC23.14 | IC17.21 63.49,80.48 64.77,79.21 65.4,79.21 BYP28.2 66.67,79.21 69.84,79.21 v71.12,80.48 82.55,80.48 85.72,77.3 IC28.8 | 123.19,63.97 86.99,63.97 IC19.8 | BYP18.2 106.04,5.55 104.77,5.55 102.23,3.01 C3.2 100.96,3.01 98.42,5.55 92.07,5.55 C6.2 | C5.2 93.98,10 92.07,8.09 C4.2 90.8,8.09 89.53,6.82 78.73,6.82 77.47,8.09 IC27.7 | IC22.14 123.82,25.23 121.92,23.33 107.31,23.33 BYP17.2 | RS-232.2 41.9,28.41 42.54,27.77 48.89,27.77 49.52,27.14 49.52,23.96 50.79,23.96 C11.2 | COM.G2 43.17,15.08 47.62,15.08 COM.5 48.25,16.34 48.89,16.98 62.86,16.98 64.13,15.71 COM.G1 | 61.59,35.39 62.86,34.12 IC20.10 | 61.59,35.39 52.7,35.39 51.43,34.12 IC20.15 | 61.59,35.39 87.62,35.39 88.26,36.03 BYP22.2
MR
  Top 0.254: R8.1 13.33,69.05 20.32,69.05 20.32,67.78 IC17.3
N$1
  Bottom 0.254: COM.4 50.79,15.08 51.43,14.44 56.51,14.44 57.14,13.81 COM.6
N$3
  Top 0.254: Q1.1 5.08,74.77 8.88,78.58 8.88,79.84 10.15,81.11 C2.1
  Bottom 0.254: IC17.39 17.14,81.11 15.87,79.84 12.69,79.84 10.79,81.75 C2.1
N$4
  Top 0.254: Q1.2 5.08,69.69 8.88,73.5 8.88,77.3 10.15,78.58 C1.2
  Bottom 0.254: IC17.38 19.68,81.11 17.78,79.21 10.79,79.21 C1.2
N$5
  Top 0.254: IC25.18 16.51,51.27 19.05,53.81 IC24.2
N$6
  Top 0.254: IC18.5 108.58,11.27 108.58,12.54 IC18.4 108.58,13.81 108.58,15.08 IC18.3
N$21
  Top 0.254: IC18.1 107.95,20.79 107.31,20.79 R1.1 106.68,20.15 105.41,18.88 105.41,17.61 101.59,13.81 C3.1
N$22
  Top 0.254: IC18.2 107.95,18.25 107.31,18.25 R2.1 106.68,17.61 105.41,16.34 105.41,4.28 106.04,3.64 JP1.2
N$23  (via drill 0.61)
  Top 0.254: 59.68,37.94 60.32,37.94 IC21.4 | 59.68,37.94 59.05,37.94 IC21.3 | v64.13,11.27 60.95,14.44 60.95,23.33 59.68,24.6 59.68,37.94
  Bottom 0.254: v64.13,11.27 67.31,11.27 68.58,12.54 74.29,12.54 74.93,13.17 IC27.5
N$24
  Top 0.254: IC26.18 15.87,23.96 17.14,25.23 17.14,30.31 19.68,32.85 IC24.10
N$25
  Top 0.254: IC26.17 15.87,21.42 17.78,23.33 17.78,28.41 19.68,30.31 IC24.11
N$27
  Top 0.254: IC27.2 75.56,20.15 74.29,18.88 R11.A 73.66,16.98 71.12,14.44 71.12,11.9 R11.S 71.75,10.63 74.93,10.63 IC27.6
  Bottom 0.254: C6.1 85.72,5.55 84.45,4.28 79.37,4.28 76.83,6.82 75.56,6.82 74.93,6.18 74.93,3.64 72.39,3.64 71.12,4.92 71.12,9.36 R11.S
N$28
  Top 0.254: IC27.1 76.83,22.7 78.1,21.42 78.1,6.82 76.83,5.55 R9.1
  Bottom 0.254: R9.1 76.83,5.55 79.37,3.01 83.18,3.01 R10.2
N$94
  Top 0.254: IC26.16 15.87,18.88 18.41,21.42 18.41,26.5 19.68,27.77 IC24.12
N$124
  Bottom 0.254: IC26.15 15.87,16.34 18.41,18.88 18.41,25.87 19.05,25.87 IC24.13
N$125
  Top 0.254: IC26.14 15.87,13.81 18.41,16.34 18.41,18.88 19.05,19.52 22.22,19.52 22.22,21.42 20.95,22.7 IC24.14
N$126
  Bottom 0.254: IC26.13 16.51,10.63 17.78,11.9 21.59,11.9 22.22,12.54 22.22,20.15 20.95,20.15 IC24.15
N$127
  Top 0.254: IC26.12 16.51,8.09 18.41,8.09 18.41,6.82 19.05,6.18 19.05,4.28 19.68,3.64 24.12,3.64 24.12,14.44 20.95,17.61 IC24.16
N$128
  Bottom 0.254: IC26.11 14.6,6.18 13.33,7.46 13.33,14.44 17.78,14.44 19.05,15.71 IC24.17
N$129
  Top 0.254: IC25.17 16.51,48.73 19.05,51.27 IC24.3
N$130
  Top 0.254: IC25.16 16.51,46.19 19.05,48.73 IC24.4
N$131
  Top 0.254: IC25.15 16.51,43.65 19.05,46.19 IC24.5
N$132
  Top 0.254: IC25.14 16.51,41.11 19.05,43.65 IC24.6
N$133
  Top 0.254: IC25.13 16.51,38.57 19.05,41.11 IC24.7
N$134
  Top 0.254: IC25.12 16.51,36.03 19.05,38.57 IC24.8
N$135
  Top 0.254: IC25.11 16.51,33.49 19.05,36.03 IC24.9
N$136
  Bottom 0.254: IC24.19 21.59,10.63 22.86,11.9 22.86,27.14 10.15,27.14 8.88,28.41 IC26.1
N$137
  Bottom 0.254: IC25.1 8.88,56.35 10.15,57.62 26.67,57.62 27.94,58.89 43.81,58.89 46.98,55.71 46.98,54.45 36.19,54.45 IC24.39
N$138  (via drill 0.61)
  Top 0.254: v45.71,55.71 46.98,54.45 46.98,16.98 46.35,16.34 46.35,13.81 58.41,1.74 81.91,1.74 81.91,8.73 83.18,10 IC27.9
  Bottom 0.254: v45.71,55.71 37.46,55.71 36.82,56.35 IC24.40
N$140
  Top 0.254: IC27.8 85.09,8.09 85.72,8.09 C4.1 | IC27.12 84.45,17.61 90.8,11.27 90.8,10.63 R4.1
  Bottom 0.254: R4.1 90.8,10.63 88.26,8.09 86.99,8.09 C4.1
N$141
  Top 0.254: R4.2 90.8,18.25 89.53,18.25 R3.1 88.9,18.88 88.9,20.79 85.09,20.79 IC27.13
N$142
  Bottom 0.254: IC27.11 85.09,15.71 93.34,15.71 C5.1
N$143
  Top 0.254: R10.1 75.56,3.01 74.29,4.28 74.29,4.92 R11.E
N$145
  Top 0.254: COM.8 52.7,13.17 53.97,13.17 COM.7
N$147  (via drill 0.61)
  Top 0.254: IC18.12 116.2,16.34 116.2,17.61 IC18.13 | v77.47,36.66 79.37,34.76 v79.37,27.77
  Bottom 0.254: v77.47,36.66 65.4,36.66 64.13,37.94 IC21.5 | v79.37,27.77 82.55,24.6 90.17,24.6 90.8,23.96 99.06,23.96 103.5,19.52 114.3,19.52 115.56,18.25 IC18.13
N$148
  Top 0.254: LED1.K 119.38,11.27 118.11,12.54 118.11,13.17 IC18.11
N$149
  Bottom 0.254: R12.1 86.99,18.25 88.26,16.98 97.15,16.98 99.69,14.44 118.74,14.44 121.92,11.27 LED1.A
N$150
  Top 0.254: IC21.24 53.34,55.08 53.34,56.35 JP2.1
  Bottom 0.254: R13.2 50.16,57.62 52.7,57.62 JP2.1
N$151  (via drill 0.61)
  Top 0.254: v123.19,37.3 123.19,24.6 120.65,22.06 120.65,9.36 117.47,6.18 IC18.8
  Bottom 0.254: v123.19,37.3 125.73,39.84 125.73,79.84 113.66,79.84 113.03,80.48 113.03,86.83 53.34,86.83 49.52,83.02 49.52,78.58 64.77,78.58 66.04,77.3 67.94,77.3 IC28.1
N$153
  Top 0.254: IC20.7 64.13,25.23 65.4,25.23 IC20.8
N$154
  Bottom 0.254: C7.1 56.51,20.79 57.14,21.42 74.29,21.42 74.93,22.06 77.47,22.06 78.1,21.42 78.1,18.88 76.83,18.88 IC27.3
N$155  (via drill 0.61)
  Top 0.254: v58.41,30.95 58.41,27.14 IC20.5
  Bottom 0.254: v58.41,30.95 59.05,31.58 67.31,31.58 68.58,32.85 C9.2
N$156
  Bottom 0.254: IC20.4 56.51,26.5 58.41,28.41 67.94,28.41 C9.1
N$157  (via drill 0.61)
  Top 0.254: v52.7,30.95 53.34,30.31 53.34,27.14 IC20.3
  Bottom 0.254: v52.7,30.95 46.35,30.95 C8.2
N$158
  Bottom 0.254: C8.1 46.35,25.87 47.62,25.87 IC20.1
N$159
  Bottom 0.254: C11.1 56.51,23.33 57.14,23.96 59.05,23.96 60.32,25.23 IC20.6
N$160
  Top 0.254: C10.2 48.89,23.33 50.16,24.6 50.16,25.23 IC20.2
PIA-A0
  Top 0.254: IC25.2 6.98,53.17 2.54,48.73 2.54,44.28 CORE-IO.1
PIA-A1
  Top 0.254: IC25.3 6.98,50.63 5.08,48.73 5.08,44.28 CORE-IO.2
PIA-A2
  Bottom 0.254: IC25.4 6.98,48.09 3.81,44.92 3.81,43.02 2.54,41.74 CORE-IO.3
PIA-A3
  Top 0.254: IC25.5 8.25,45.55 9.52,44.28 9.52,43.02 8.88,42.38 5.08,42.38 5.08,41.74 CORE-IO.4
PIA-A4
  Bottom 0.254: IC25.6 8.25,43.02 9.52,41.74 9.52,39.84 4.44,39.84 3.17,38.57 CORE-IO.5
PIA-A5
  Top 0.254: IC25.7 6.98,40.48 5.71,39.2 5.71,38.57 CORE-IO.6
PIA-A6
  Bottom 0.254: IC25.8 6.98,37.94 6.34,37.3 4.44,37.3 3.17,36.03 CORE-IO.7
PIA-A7
  Top 0.254: IC25.9 6.34,36.03 5.71,36.03 CORE-IO.8
PIA-B0
  Bottom 0.254: IC26.2 6.98,26.5 6.34,27.14 4.44,27.14 3.17,28.41 CORE-IO.13
PIA-B1
  Top 0.254: IC26.3 6.98,22.7 6.34,22.7 5.71,22.06 3.81,22.06 3.81,26.5 5.08,27.77 CORE-IO.14
PIA-B2
  Bottom 0.254: IC26.4 6.98,20.15 6.34,19.52 4.44,19.52 3.81,20.15 3.81,25.23 2.54,25.23 CORE-IO.15
PIA-B3
  Top 0.254: IC26.5 8.25,18.88 9.52,20.15 9.52,23.96 8.88,24.6 5.08,24.6 5.08,25.23 CORE-IO.16
PIA-B4
  Bottom 0.254: IC26.6 6.34,15.71 2.54,19.52 1.9,19.52 1.27,20.15 1.27,23.33 1.9,23.33 CORE-IO.17
PIA-B5
  Bottom 0.254: IC26.7 8.25,13.81 9.52,15.08 9.52,22.06 5.71,22.06 5.08,22.7 CORE-IO.18
PIA-B6
  Top 0.254: IC26.8 6.98,11.27 2.54,15.71 2.54,20.15 CORE-IO.19
PIA-B7
  Top 0.254: IC26.9 8.25,8.73 9.52,10 9.52,16.34 8.88,16.98 5.08,16.98 5.08,20.15 CORE-IO.20
R/!W  (via drill 0.61)
  Top 0.254: 92.7,23.96 85.72,23.96 85.72,40.48 81.28,44.92 81.28,52.54 IC21.13 | 92.7,23.96 94.61,23.96 95.25,24.6 95.25,38.57 93.98,39.84 IC22.27 | IC24.21 34.92,8.73 31.75,11.9 31.75,79.21 30.48,80.48 IC17.34 | v92.7,4.28 92.7,23.96
  Bottom 0.254: v92.7,4.28 90.17,1.74 47.62,1.74 41.27,8.09 36.82,8.09 IC24.21
RX
  Top 0.254: IC20.12 58.41,34.76 55.88,37.3 IC21.2
RXD  (via drill 0.61)
  Top 0.254: IC20.13 55.88,32.22 57.14,30.95 57.14,19.52 60.32,16.34 60.32,15.08 59.68,14.44 53.34,14.44 53.34,15.08 COM.3 53.34,16.34 53.34,20.79 v52.06,22.06
  Bottom 0.254: v52.06,22.06 41.27,22.06 41.27,25.23 RS-232.3
TX
  Top 0.254: IC20.11 60.95,32.22 64.77,28.41 67.31,28.41 67.31,36.03 66.04,37.3 IC21.6
TXD
  Top 0.254: IC20.14 53.34,32.22 54.6,30.95 54.6,17.61 55.88,16.34 COM.2
  Bottom 0.254: RS-232.1 41.9,30.95 43.17,32.22 46.98,32.22 47.62,31.58 51.43,31.58 52.7,32.85 IC20.14
VCC  (via drill 0.61)
  Top 0.508: C10.1 43.17,22.7 43.17,21.42 BYP20.1 42.54,20.79 37.46,15.71 36.82,15.71 IC24.24 34.92,15.08 33.65,13.81 33.65,12.54 34.92,11.27 IC24.22 | R5.2 10.79,76.67 12.06,76.67 R8.2 | IC17.36 26.03,81.11 27.3,81.11 IC17.35 | IC26.20 15.23,29.04 15.23,30.31 BYP26.1 | IC25.20 15.23,56.98 15.23,58.25 BYP25.1 | R2.2 99.06,18.88 99.06,20.15 R1.2 99.69,20.79 101.59,22.7 BYP17.1 | 88.26,10.63 88.26,6.82 85.72,6.82 84.45,5.55 R9.2 | 88.26,10.63 R3.2 88.26,10.63 | 88.26,10.63 86.99,10.63 R12.2 | IC27.10 83.18,13.81 v81.28,15.71 81.28,20.79 83.18,22.7 IC27.14 83.81,23.96 83.81,25.23 BYP27.1 83.81,26.5 81.28,29.04 81.28,37.3 IC21.12 | BYP29.1 89.53,81.75 90.8,81.75 IC29.28 91.44,80.48 91.44,67.78 IC29.1 91.44,65.24 91.44,62.7 IC23.28 91.44,60.16 91.44,47.46 IC23.1 91.44,44.92 91.44,42.38 IC22.28 | IC20.16 48.25,34.76 50.79,37.3 50.79,37.94 BYP21.1 | v45.71,38.57 45.71,48.09 R7.2 | BYP28.1 66.67,84.29 67.94,84.29 IC28.16 68.58,83.02 68.58,80.48 67.31,79.21 67.31,74.13 68.58,72.86 IC19.16 68.58,70.32 69.84,69.05 69.84,41.11 71.12,39.84 IC21.8 | R6.2 86.36,50.63 88.9,48.09 88.9,41.74 BYP22.1 | v57.14,48.73 57.14,55.08 55.88,56.35 JP2.2
  Bottom 0.508: R14.2 17.78,6.18 19.05,7.46 19.68,7.46 IC24.20 21.59,8.09 24.12,10.63 34.28,10.63 IC24.22 | 19.05,78.58 22.22,78.58 24.76,81.11 IC17.36 | 19.05,78.58 15.23,78.58 13.33,76.67 R8.2 | 3.17,32.22 2.54,32.85 CORE-IO.9 | 3.17,32.22 4.44,30.95 CORE-IO.12 | 13.33,32.22 14.6,30.95 BYP26.1 | 13.33,32.22 3.17,32.22 | JP4.2 8.25,60.8 8.88,60.16 13.33,60.16 14.6,58.89 BYP25.1 15.87,58.89 17.14,60.16 19.05,60.16 | 28.57,61.43 32.38,65.24 33.02,65.24 IC17.8 | 27.3,60.16 28.57,61.43 | 27.3,60.16 26.03,58.89 BYP24.1 | 28.57,61.43 53.34,61.43 55.88,58.89 JP2.2 | 19.05,60.16 27.3,60.16 | 13.33,32.22 13.33,56.35 13.96,56.35 IC25.20 | 19.05,60.16 19.05,78.58 | IC24.24 34.92,16.34 21.59,29.68 17.78,29.68 16.51,28.41 IC26.20 | IC18.14 115.56,20.79 114.3,22.06 103.5,22.06 102.23,23.33 BYP17.1 | v81.28,15.71 77.47,15.71 IC27.4 | 86.36,13.17 85.09,13.17 IC27.10 | 86.36,13.17 93.34,13.17 95.25,11.27 105.41,11.27 106.04,10.63 BYP18.1 | 86.36,13.17 86.36,11.27 R12.2 | R1.2 98.42,20.79 95.88,23.33 85.09,23.33 IC27.14 | BYP23.1 86.99,61.43 90.8,61.43 IC23.28 92.07,60.8 93.34,60.8 IC23.27 | v45.71,38.57 50.16,38.57 BYP21.1 50.79,37.94 52.06,36.66 59.05,36.66 59.68,37.3 59.68,40.48 73.02,40.48 | BYP19.1 66.67,71.59 67.94,71.59 IC19.16 | 73.02,40.48 71.75,39.2 IC21.8 | 73.02,40.48 74.29,40.48 | 74.29,40.48 75.56,39.2 IC21.10 | 74.29,40.48 79.37,40.48 80.64,39.2 IC21.12 81.91,39.2 83.81,41.11 88.26,41.11 BYP22.1 89.53,41.11 90.8,41.11 IC22.28 | v57.14,48.73 46.35,48.73 R7.2
VMA  (via drill 0.61)
  Top 0.254: v74.93,73.5 74.93,46.19 72.39,43.65 v72.39,34.12 | v115.56,30.95 115.56,22.06 114.93,21.42 114.93,10 116.2,8.73 IC18.9
  Bottom 0.254: v74.93,73.5 32.38,73.5 26.03,67.14 IC17.5 | v72.39,34.12 75.56,30.95 v115.56,30.95

### Text on the board
Top: Component Side
Bottom: Solder side | PA8PDP/VRS
tPlace: RealConsole CORE - Rev.1 | +
tValues: - | + | TxD